# EAGLE design LTC3108breakout (EAGLE 5.10)
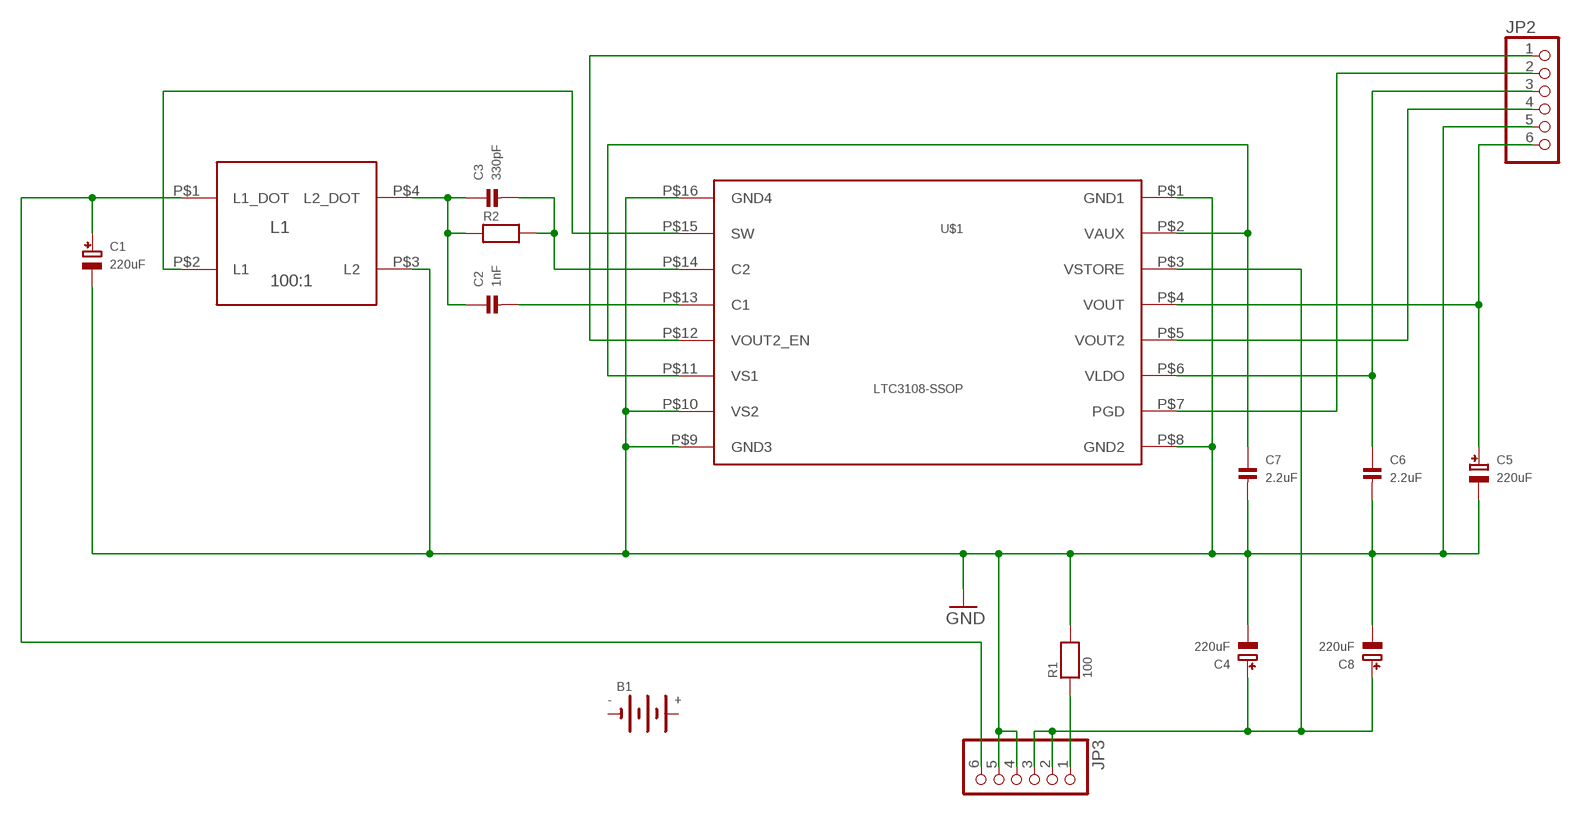
[diagram p0: schematic, sheet 1]

## Parts
B1  BATTERY  [JSTPH2]
C1  220uF  CAP_TANTALUMD/7343_REFLOW  [EIA7343-31/D-R]
C2  1nF  CAP_CERAMIC0603  [0603]
C3  330pF  CAP_CERAMIC0603  [0603]
C4  220uF  CAP_TANTALUMD/7343_REFLOW  [EIA7343-31/D-R]
C5  220uF  CAP_TANTALUMD/7343_REFLOW  [EIA7343-31/D-R]
C6  2.2uF  CAP_CERAMIC0603  [0603]
C7  2.2uF  CAP_CERAMIC0603  [0603]
C8  220uF  CAP_TANTALUMD/7343_REFLOW  [EIA7343-31/D-R]
JP2  HEADER-1X6ROUND  [1X06_ROUND]
JP3  HEADER-1X6ROUND  [1X06_ROUND]
L1  100:1  COILCRAFT_LPR6235-752SML  [COILCRAFT_LPR6235]
R1  100  RESISTOR0603  [0603]
R2  RESISTOR0603  [0603]
U$1  LTC3108-SSOP  [SSOP-GN-16]

## Nets
GND: C1.- C4.- C5.- C6.2 C7.2 C8.- JP2.5 JP3.4 JP3.5 L1.P$3(L2) R1.2 U$1.P$1(GND1) U$1.P$8(GND2) U$1.P$9(GND3) U$1.P$10(VS2) U$1.P$16(GND4)
N$1: C1.+ JP3.6 L1.P$1(L1_DOT)
N$2: L1.P$2(L1) U$1.P$15(SW)
N$3: C3.2 R2.2 U$1.P$14(C2)
N$4: C2.2 U$1.P$13(C1)
N$5: C2.1 C3.1 L1.P$4(L2_DOT) R2.1
N$6: C7.1 U$1.P$2(VAUX) U$1.P$11(VS1)
N$7: C4.+ C8.+ JP3.2 JP3.3 U$1.P$3(VSTORE)
N$8: C5.+ JP2.6 U$1.P$4(VOUT)
N$9: JP3.1 R1.1
N$10: C6.1 JP2.3 U$1.P$6(VLDO)
N$11: JP2.1 U$1.P$12(VOUT2_EN)
N$12: JP2.2 U$1.P$7(PGD)
N$13: JP2.4 U$1.P$5(VOUT2)
Unconnected: B1.1(-) B1.2(+)

## Library data of the parts
B1 = microbuilder:BATTERY
C1 C4 C5 C8 = microbuilder:CAP_TANTALUM: Tantalum Capacitors Wave footprints have larger pads and are meant to be used for hand soldering. Reflow footprints are optimised for solder paste and a reflow oven. EIA3216-18/A-[R/W] - Size A / 3216-18 / 1206 footprint 4.7µF 25V 10% Tantalum Capacitor 10µF 16V 10% Tantalum Capacitor [Digikey: 495-2236-2-ND] EIA3528-21/B-[R/W] - Size B / 3528-21 47µF 10V 10% Tantalum Capactior [Digikey: 495-2216-1-ND] EIA6032-28/C-[R/W] - Size C / 6032-28 10µF 35V 20% Tantalum Capacitor [Digikey: 495-2285-1-ND] 100µF 16V 10% Tantalum Capactior [Digikey: 399-5214-1-ND]
C2 C3 C6 C7 = microbuilder:CAP_CERAMIC: Ceramic Capacitors 0402 - 0402 Surface Mount Capacitors 0.1uF 10V 10% [Digikey: 490-1318-2-ND] 0603 - 0603 Surface Mount Capacitors 16 pF 50V 5% [Digikey: 445-5051-2-ND] 22 pF 50V [Digikey: PCC220ACVTR-ND] 33 pF 50V 5% [Digikey: 490-1415-1-ND] 56pF 50V 5% [Digikey: 490-1421-1-ND] 220pF 50V 5% [Digikey: 445-1285-1-ND] 680 pF 50V 2200 pF 50V 5% C0G [Digikey: 445-1297-1-ND] 5600 pF 100V 5% X7R [Digikey: 478-3711-1-ND] 0.1 µF 25V 10% [Digikey: PCC2277TR-ND] 0.22 µF 16V 10% X7R [Digikey: 445-1318-1-ND] 1.0 µF 25V 10% [Digikey: 445-5146-2-ND] 0603 - RF Specific 3pF 250V +/-0.1pF RF [Digikey: 712-1347-1-ND] 18 pF 250V 5% [Digikey: 478-3505-1-ND or 712-1322-1-ND] 56 pF 250V 5% C0G RF [Digikey: 490-4867-1-ND] 68 pF 250V RF [Digikey: 490-4868-1-ND] 0805 - 0805 Surface Mount Capacitors 220 pF 250V 2% RF Ceramic Capacitor [Digikey: 712-1398-1-ND] 1000 pF 50V 2% NP0 Ceramic Capacitor [Digikey: 478-3760-1-ND] 0.1 µF 25V 10% Ceramic Capacitor [Digikey: PCC1828TR-ND] 1.0 µF 16V 10% Ceramic Capacitor[Digikey: 490-1691-2-ND] 10.0 µF 10V 10% Ceramic Capacitor[Digikey: 709-1228-1-ND] 1206 - 1206 Surface Mount Capacitors
JP2 JP3 = microbuilder:HEADER-1X6: PIN HEADER
L1 = wa7iut:COILCRAFT_LPR6235-752SML: Coil Craft LPR6235-752SML
R1 R2 = microbuilder:RESISTOR: Resistors 0402 - 0402 Surface Mount Package 10.0K 1% 1/16W [Digikey: 311-10.0KLRTR-ND] 0603 - 0603 Surface Mount Package 0 Ohm 1/10 Watt 1% Resistor 15 Ohm 1/10 Watt 1% Resistor 33 Ohm 1/10 Watt 1% Resistor 49.9 Ohm 1/10 Watt 1% Resistor 100 Ohm 1/10 Watt 1% Resistor 150 Ohm 1/10 Watt 1% Resistor 240 Ohm 1/10 Watt 1% Resistor 390 Ohm 1/10 Watt 1% Resistor 560 Ohm 1/10 Watt 1% Resistor 750 Ohm 1/10 Watt 1% Resistor 1.0K Ohm 1/10 Watt 1% Resistor 1.5K Ohm 1/10 Watt 1% Resistor 2.0K Ohm 1/10 Watt 1% Resistor 4.7K Ohm 1/10 Watt 1% Resistor 10.0K Ohm 1/10 Watt 1% Resistor 20.0K Ohm 1/10 Watt 1% Resistor 33.0K Ohm 1/10 Watt 1% Resistor 100.0K Ohm 1/10 Watt 1% Resistor 0805 - 0805 Surface Mount Package 0 Ohm 1/8 Watt 1% Resistor 33 Ohm 1/8 Watt 1% Resistor 100 Ohm 1/8 Watt 1% Resistor 150 Ohm 1/8 Watt 1% Resistor 200 Ohm 1/8 Watt 1% Resistor 240 Ohm 1/8 Watt 1% Resistor 330 Ohm 1/8 Watt 1% Resistor 390 Ohm 1/8 Watt 1% Resistor 470 Ohm 1/8 Watt 1% Resistor 1.0K Ohm 1/8 Watt 1% Resistor 1.5K Ohm 1/8 Watt 1% Resistor 2.0K Ohm 1/8 Watt 1% Resistor 4.7K Ohm 1/8 Watt 1% Resistor 5.1K Ohm 1/8 Watt 1% Resistor 5.6K Ohm 1/8 Watt 1% Resistor 10.0K Ohm 1/8 Watt 1% Resistor 22.0K Ohm 1/8 Watt 1% Resistor 33.0K Ohm 1/8 Watt 1% Resistor 100K Ohm 1/8 Watt 1% Resistor 1206 - 1206 Surface Mount Package
U$1 = wa7iut:LTC3108-SSOP: LTC3108 in16 pin SSOP Narrow GN Package

## Board
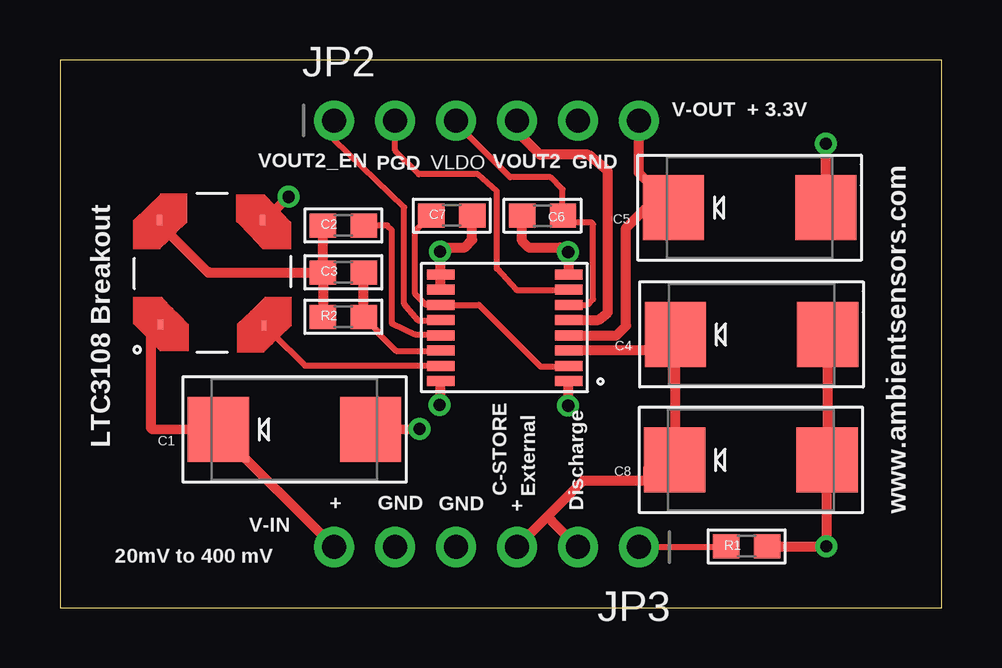
[diagram p1: board, top side]
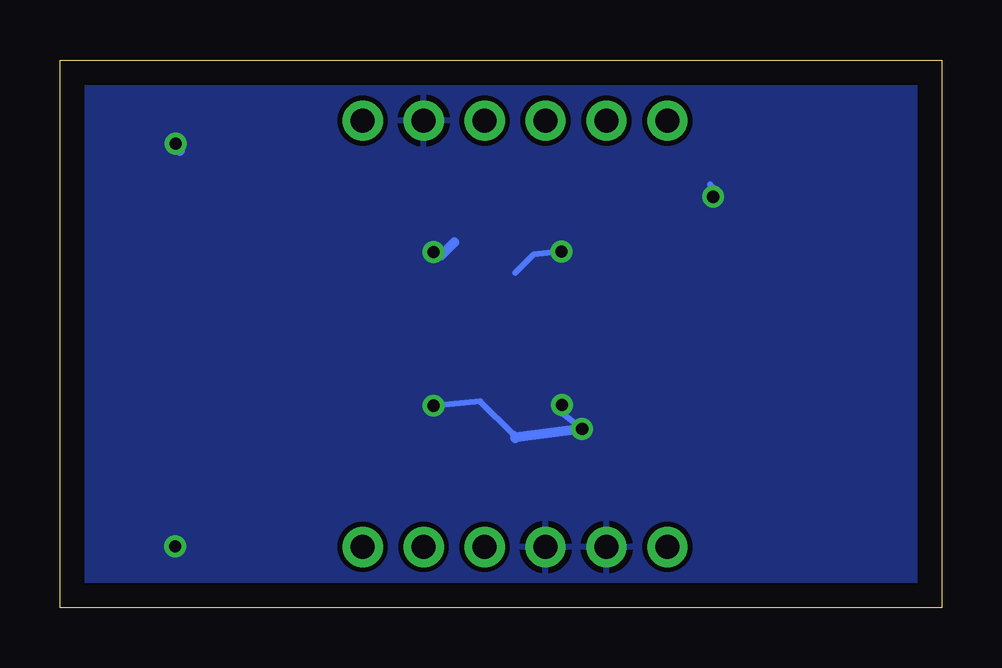
[diagram p2: board, bottom side, seen from below]

Size 36.75 x 22.85 mm. Coordinates in mm from the lower left corner, seen from the top.
Outline: 0,0 36.75,0 36.75,22.85 0,22.85 0,0
Copper layers (1*16): Top 0.035mm / dielectric 1.5mm / Bottom 0.035mm
Design rules "default": minimum track width 10mil, minimum drill 24mil, track to track 8mil, track to pad 8mil, pad to pad 8mil, via to via 8mil, smd to smd 8mil, copper to edge 40mil, drill to drill 8mil, minimum pad ring 10mil, minimum via ring 8mil, stop-mask expansion 4mil, vias tented up to drill 0mil, thermal gap 10mil

### Footprints (pad centres in the part's own frame; a part is rotated, then mirrored left to right if it is on the bottom)
EIA7343-31/D-R = smd 2.55 x 2.7: + 3.175,0; - -3.175,0
0603 = smd 1.1 x 1: 1 -0.85,0; 2 0.85,0
1X06_ROUND = drill 1 pad 1.676 round: 1 -6.35,0; 2 -3.81,0; 3 -1.27,0; 4 1.27,0; 5 3.81,0; 6 6.35,0
COILCRAFT_LPR6235 = smd 0.406 x 0.203: P$1 -2.15,2.15; P$2 -2.2,-2.15; P$3 2.2,-2.1; P$4 2.2,2.2
SSOP-GN-16 = smd 0.419 x 1.143: P$1 -2.222,-2.662; P$2 -1.587,-2.662; P$3 -0.952,-2.662; P$4 -0.317,-2.662; P$5 0.318,-2.662; P$6 0.953,-2.662; P$7 1.588,-2.662; P$8 2.223,-2.662; P$9 2.223,2.67; P$10 1.587,2.67; P$11 0.953,2.67; P$12 0.318,2.67; P$13 -0.318,2.67; P$14 -0.953,2.67; P$15 -1.587,2.67; P$16 -2.223,2.67

### Placement (x,y rotation side)
C1  9.78,7.44 180 top
C2  11.81,15.95 0 top
C3  11.81,14 0 top
C4  28.83,11.4 180 top
C5  28.75,16.69 180 top
C6  20.12,16.36 180 top
C7  16.33,16.36 0 top
C8  28.8,6.17 180 top
JP2  17.78,20.32 0 top
JP3  17.78,2.54 180 top
L1  6.35,13.97 90 top
R1  28.63,2.57 0 top
R2  11.81,12.14 0 top
U$1  18.54,11.68 90 top

### Tracks (layer width: path | path; a pad name or v marks a point on that pad's centre or on a via)
GND  (via drill 0.51)
  Top 0.254: L1.P$3 8.55,16.17 | v14.99,7.47 15.06,7.67 | 15.87,14.78 v15.85,14.86 | v21.18,14.83 21.2,14.69
  Top 0.406: 8.55,16.17 v9.53,17.14 | C1.- v14.99,7.47 | U$1.P$16 15.87,8.69 v15.82,8.46 | U$1.P$1 21.2,8.66 v21.18,8.43 | 15.87,14.78 U$1.P$9 U$1.P$10 | 21.2,14.69 U$1.P$8 | C6.2 19.27,15.3 19.53,15.04 20.85,15.04 v21.18,14.83 | C5.- v31.93,19.36 | R1.2 v31.95,2.56 31.98,2.59 C8.- 32,6.2 C4.- | C7.2 17.18,15.35 16.87,15.04 16.03,15.04 v15.85,14.86
  Bottom 0.254: v9.53,17.14 9.53,17.53 9.65,17.65 | v15.82,8.46 15.82,8.13 v14.99,7.47 | v21.18,8.43 19.24,8.61 17.86,7.23 | v15.85,14.86 17.02,14.73 17.78,13.97
  Bottom 0.305: 17.74,7.11 17.86,7.23
  Bottom 0.406: v14.99,7.47 17.74,7.11 17.78,7.07 | v21.18,14.83 20.85,14.71 20.32,15.24 | v31.93,19.36 31.93,19.23 31.75,19.05 | v31.95,2.56 31.77,2.56 31.75,2.54
  pour Bottom: 0,22.86 0,0 36.83,0 36.83,22.86
N$1
  Top 0.254: C1.+ 6.71,7.26
  Top 0.406: L1.P$1 4.2,11.77 3.81,11.38 3.81,7.47 C1.+ | 6.71,7.26 JP3.6
N$2
  Top 0.254: L1.P$2 8.82,11.45 8.87,11.45 10.21,10.11 U$1.P$15
N$3
  Top 0.254: U$1.P$14 15.86,10.72 14.02,10.72 13.27,11.47 13.27,11.53 R2.2
  Top 0.406: R2.2 C3.2
N$4
  Top 0.254: U$1.P$13 15.83,11.4 14.81,11.4 13.84,11.86 13.84,15.75 13.64,15.95 C2.2
N$5
  Top 0.254: 6.2,13.97 6.22,13.99 | L1.P$4 4.57,15.75
  Top 0.406: 6.2,13.97 4.57,15.6 4.57,15.75 | C3.1 R2.1 | C3.1 C2.1 | 6.22,13.99 C3.1
N$6
  Top 0.254: C7.1 15.38,16.3 14.81,15.72 14.81,13.08 15.25,12.64 U$1.P$11 17.46,12.64 20.04,10.06 21.17,10.06 U$1.P$2
N$7
  Top 0.254: C8.+ 24.51,5.97 | 24.43,5.38 24.43,5.87 C8.+ | 24.33,5.31 C8.+ | 20.47,3.66 20.47,3.68 20.33,3.82 | C4.+ 24.98,10.73 | C8.+ 25.65,6.2
  Top 0.406: JP3.3 20.33,3.82 21.82,5.31 24.33,5.31 | 20.47,3.66 JP3.2 | 24.98,10.73 U$1.P$3 | 25.65,6.2 C4.+
N$8
  Top 0.254: 24.64,16.89 C5.+
  Top 0.406: U$1.P$4 23.2,11.37 23.6,11.76 23.6,15.85 24.64,16.89 | JP2.6 24.13,18.14 C5.+
N$9
  Top 0.254: 24.13,2.56 JP3.1 27.94,2.54 R1.1
N$10
  Top 0.254: U$1.P$6 21.98,12.64 22.23,12.88 22.23,16 22.15,16.08 21.25,16.08 C6.1 20.95,16.37 20.95,17.45 20.45,17.96 18.77,17.96 16.51,20.22 JP2.3
N$11
  Top 0.254: JP2.1 11.43,19.53 14.35,16.71 14.35,12.68 14.94,11.99 U$1.P$12
N$12
  Top 0.254: JP2.2 13.97,19.07 14.96,18.09 17.42,18.09 18.21,17.37 18.21,14.15 19.02,13.26 U$1.P$7
N$13
  Top 0.406: JP2.4 19.05,19.86 20.02,18.9 22.02,18.9 22.84,18.21 22.84,12.32 22.45,12.01 21.22,12.01 U$1.P$5

### Text on the board
tPlace: V-OUT + 3.3V | VOUT2_EN | PGD | VLDO | VOUT2 | GND | LTC3108 Breakout | C-STORE | External | + | GND | GND | + | Discharge | www.ambientsensors.com | V-IN | 20mV to 400 mV